# EAGLE design sim800 (EAGLE 9.2.2)

## Sheet 1 of 3
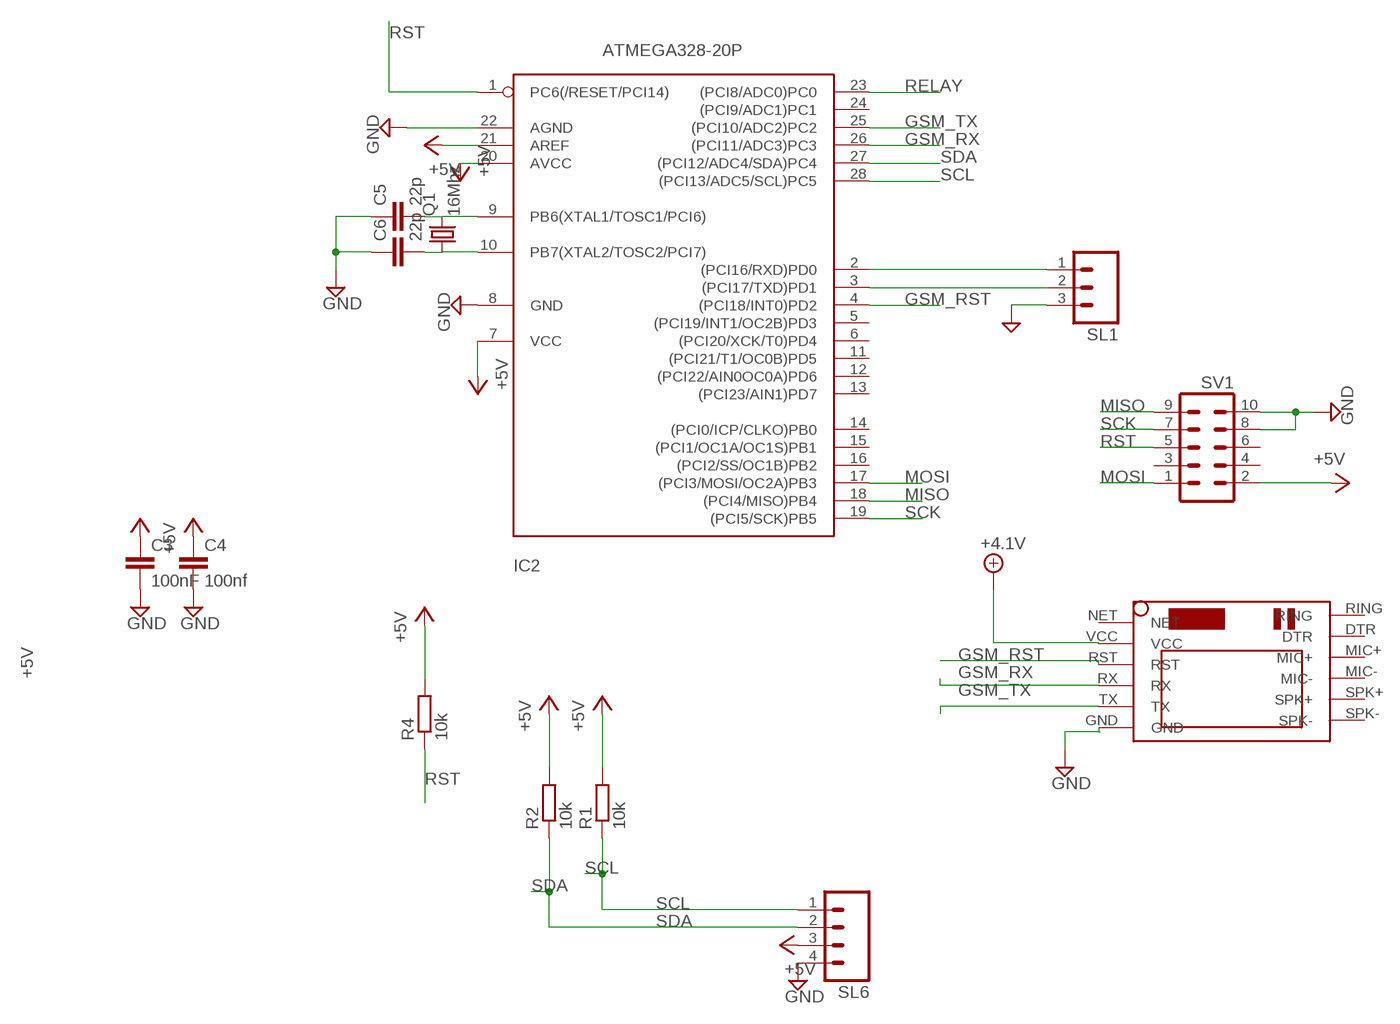
[diagram p0: schematic, sheet 1]

### Parts
C3  100nF  C-EU050-025X075  [C050-025X075]
C4  100nf  C-EU050-025X075  [C050-025X075]
C5  22p  C-EU025-025X050  [C025-025X050]
C6  22p  C-EU025-025X050  [C025-025X050]
IC2  ATMEGA328-20P  [DIL28-3]
Q1  16Mhz  CRYSTALHC49U-V  [HC49U-V]
R1  10k  R-EU_0207/10  [0207/10]
R2  10k  R-EU_0207/10  [0207/10]
R4  10k  R-EU_0207/10  [0207/10]
SL1  M03  [03P]
SL6  M04  [04P]
SV1  ML10  [ML10]
U$1  SIM800LMODULE  [SIM800LMODULE]

### Nets
+4.1V: U$1.VCC ; also sheet 3
+5V: C3.1 C4.1 IC2.7(VCC) IC2.20(AVCC) IC2.21(AREF) R1.2 R2.2 R4.2 SL6.3 SV1.2 ; also sheet 2,3
GND: C3.2 C4.2 C5.1 C6.1 IC2.8(GND) IC2.22(AGND) SL1.3 SL6.4 SV1.8 SV1.10 U$1.GND ; also sheet 2,3
GSM_RST: IC2.4((PCI18/INT0)PD2) U$1.RST
GSM_RX: IC2.26((PCI11/ADC3)PC3) U$1.RX
GSM_TX: IC2.25((PCI10/ADC2)PC2) U$1.TX
MISO: IC2.18((PCI4/MISO)PB4) SV1.9
MOSI: IC2.17((PCI3/MOSI/OC2A)PB3) SV1.1
N$1: C5.2 IC2.9(PB6(XTAL1/TOSC1/PCI6)) Q1.2
N$2: C6.2 IC2.10(PB7(XTAL2/TOSC2/PCI7)) Q1.1
N$3: IC2.2((PCI16/RXD)PD0) SL1.1
N$6: IC2.3((PCI17/TXD)PD1) SL1.2
RELAY: IC2.23((PCI8/ADC0)PC0) ; also sheet 2
RST: IC2.1(PC6(/RESET/PCI14)) R4.1 SV1.5
SCK: IC2.19((PCI5/SCK)PB5) SV1.7
SCL: IC2.28((PCI13/ADC5/SCL)PC5) R1.1 SL6.1
SDA: IC2.27((PCI12/ADC4/SDA)PC4) R2.1 SL6.2
Unconnected: IC2.5((PCI19/INT1/OC2B)PD3) IC2.6((PCI20/XCK/T0)PD4) IC2.11((PCI21/T1/OC0B)PD5) IC2.12((PCI22/AIN0OC0A)PD6) IC2.13((PCI23/AIN1)PD7) IC2.14((PCI0/ICP/CLKO)PB0) IC2.15((PCI1/OC1A/OC1S)PB1) IC2.16((PCI2/SS/OC1B)PB2) IC2.24((PCI9/ADC1)PC1) SV1.3 SV1.4 SV1.6 U$1.DTR U$1.MIC+ U$1.MIC- U$1.NET U$1.RING U$1.SPK+ U$1.SPK-

## Sheet 2 of 3
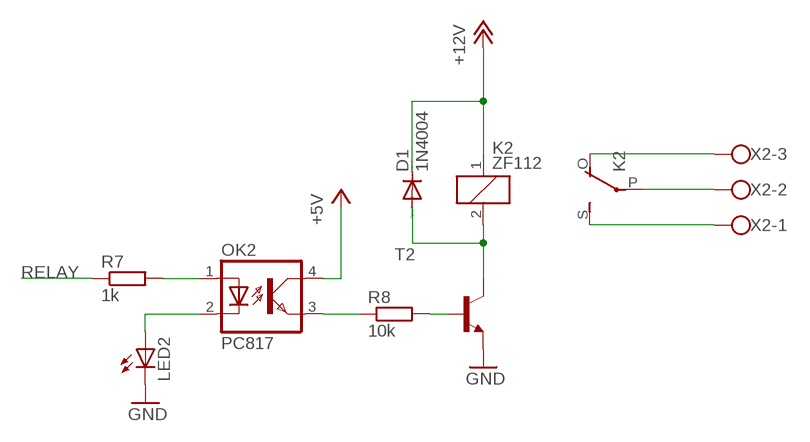
[diagram p1: schematic, sheet 2]

### Parts
D1  1N4004  [DO41-10]
K2  ZF112  [ZF112]
LED2  LED3MM  [LED3MM]
OK2  PC817  [DIL04]
R7  1k  R-EU_0207/10  [0207/10]
R8  10k  R-EU_0207/10  [0207/10]
T2  -NPN-TO92-EBC  [TO92-EBC]
X2  W237-103  [W237-103]

### Nets
+5V: OK2.4(COL) ; also sheet 1,3
+12V: D1.C K2.1 ; also sheet 3
GND: LED2.K(C) T2.E ; also sheet 1,3
N$14: OK2.1(A) R7.2
N$15: LED2.A OK2.2(C)
N$16: OK2.3(EMIT) R8.1
N$17: R8.2 T2.B
N$18: D1.A K2.2 T2.C
N$19: K2.P(2:P) X2.2
N$20: K2.S(2:S) X2.1
N$21: K2.O(2:O) X2.3
RELAY: R7.1 ; also sheet 1

## Sheet 3 of 3
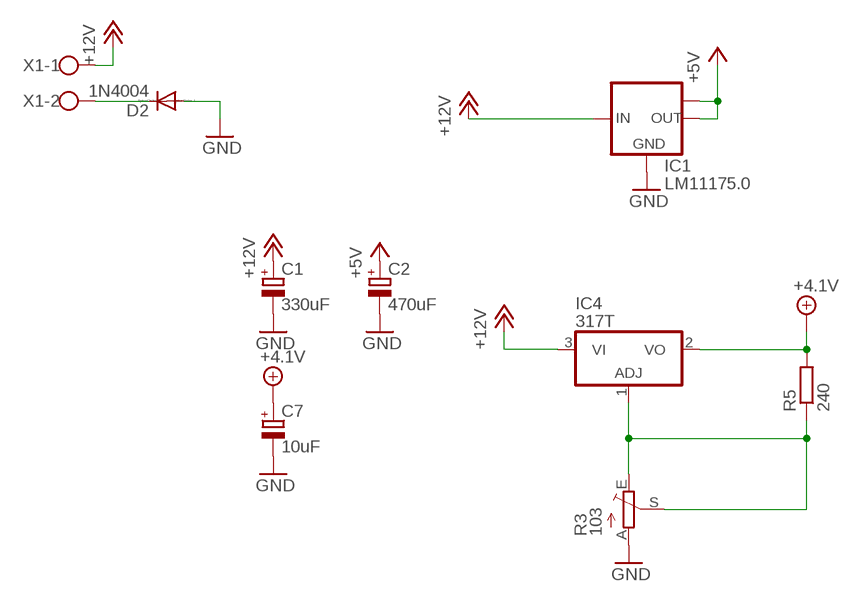
[diagram p2: schematic, sheet 3]

### Parts
C1  330uF  CPOL-EUE3.5-8  [E3,5-8]
C2  470uF  CPOL-EUE3.5-8  [E3,5-8]
C7  10uF  CPOL-EUE2.5-6  [E2,5-6]
D2  1N4004  [DO41-10]
IC1  LM11175.0  LM1117MPX-5.0  [SOT223]
IC4  317T  [TO220H]
R3  103  TRIM_EU-CA6V  [CA6V]
R5  240  R-EU_0207/10  [0207/10]
X1  W237-102  [W237-102]

### Nets
+4.1V: C7.+ IC4.2(VO) R5.2 ; also sheet 1
+5V: C2.+ IC1.2(OUT) IC1.TAB(OUT1) ; also sheet 1,2
+12V: C1.+ IC1.3(IN) IC4.3(VI) X1.1 ; also sheet 2
GND: C1.- C2.- C7.- D2.A IC1.1(GND) R3.A ; also sheet 1,2
N$4: D2.C X1.2
N$7: IC4.1(ADJ) R3.E R3.S R5.1

## Library data of the parts
C1 C2 C7 = rcl:CPOL-EU: POLARIZED CAPACITOR, European symbol; SPICEPREFIX: C
C3-C6 = rcl:C-EU: CAPACITOR, European symbol
D1 D2 = diode:1N4004: DIODE general purpose rectifier, 1 A
IC1 = lm1117:LM1117MPX-*
IC2 = atmega328:ATMEGA328*P: MICROCONTROLLER 32 kBytes FLASH 2 kBytes SRAM 1 kBytes EEPROM USART 8-channel 10 bit ADC
IC4 = linear:*317: Positive VOLTAGE REGULATOR
K2 = relay:ZF112: RELAY 1 x switch; OC_FARNELL: unknown; OC_NEWARK: unknown
LED2 = led:LED: LED OSRAM: - CHIPLED LG R971, LG N971, LY N971, LG Q971, LY Q971, LO R971, LY R971 LH N974, LH R974 LS Q976, LO Q976, LY Q976 LO Q996 - Hyper CHIPLED LW Q18S LB Q993, LB Q99A, LB R99A - SideLED LS A670, LO A670, LY A670, LG A670, LP A670 LB A673, LV A673, LT A673, LW A673 LH A674 LY A675 LS A676, LA A676, LO A676, LY A676, LW A676 LS A679, LY A679, LG A679 - Hyper Micro SIDELED® LS Y876, LA Y876, LO Y876, LY Y876 LT Y87S - SmartLED LW L88C, LW L88S LB L89C, LB L89S, LG L890 LS L89K, LO L89K, LY L89K LS L896, LA L896, LO L896, LY L896 - TOPLED LS T670, LO T670, LY T670, LG T670, LP T670 LSG T670, LSP T670, LSY T670, LOP T670, LYG T670 LG T671, LOG T671, LSG T671 LB T673, LV T673, LT T673, LW T673 LH T674 LS T676, LA T676, LO T676, LY T676, LB T676, LH T676, LSB T676, LW T676 LB T67C, LV T67C, LT T67C, LS T67K, LO T67K, LY T67K, LW E67C LS E67B, LA E67B, LO E67B, LY E67B, LB E67C, LV E67C, LT E67C LW T67C LS T679, LY T679, LG T679 LS T770, LO T770, LY T770, LG T770, LP T770 LB T773, LV T773, LT T773, LW T773 LH T774 LS E675, LA E675, LY E675, LS T675 LS T776, LA T776, LO T776, LY T776, LB T776 LHGB T686 LT T68C, LB T68C - Hyper Mini TOPLED® LB M676 - Mini TOPLED Santana® LG M470 LS M47K, LO M47K, LY M47K Source: http://www.osram.convergy.de LUXEON: - LUMILED® LXK2-PW12-R00, LXK2-PW12-S00, LXK2-PW14-U00, LXK2-PW14-V00 LXK2-PM12-R00, LXK2-PM12-S00, LXK2-PM14-U00 LXK2-PE12-Q00, LXK2-PE12-R00, LXK2-PE12-S00, LXK2-PE14-T00, LXK2-PE14-U00 LXK2-PB12-K00, LXK2-PB12-L00, LXK2-PB12-M00, LXK2-PB14-N00, LXK2-PB14-P00, LXK2-PB14-Q00 LXK2-PR12-L00, LXK2-PR12-M00, LXK2-PR14-Q00, LXK2-PR14-R00 LXK2-PD12-Q00, LXK2-PD12-R00, LXK2-PD12-S00 LXK2-PH12-R00, LXK2-PH12-S00 LXK2-PL12-P00, LXK2-PL12-Q00, LXK2-PL12-R00 Source: www.luxeon.com KINGBRIGHT: KA-3528ASYC Source: www.kingbright.com
OK2 = optocoupler:PC817: SHARP OPTO COUPLER; MPN: PC817X4J000F; OC_FARNELL: 9707727; OC_NEWARK: 97K7059
Q1 = crystal:CRYSTAL: CRYSTAL; OC_FARNELL: 1666969; OC_NEWARK: unknown
R1 R2 R4 R5 R7 R8 = rcl:R-EU_: RESISTOR, European symbol; SPICEPREFIX: R
R3 = pot:TRIM_EU-: POTENTIOMETER
SL1 = con-amp-quick:M03: AMP QUICK CONNECTOR; OC_FARNELL: unknown; OC_NEWARK: unknown
SL6 = con-amp-quick:M04: AMP QUICK CONNECTOR; OC_FARNELL: unknown; OC_NEWARK: unknown
SV1 = con-harting-ml:ML10: HARTING; OC_FARNELL: unknown; OC_NEWARK: unknown
T2 = transistor:*-NPN-: NPN Transistror BF959 corrected 2008.03.06
U$1 = SIM800LMODULE:SIM800LMODULE: SIM800L Module
X1 = con-wago-500:W237-102: WAGO SCREW CLAMP; MPN: 237-102; OC_FARNELL: unknown; OC_NEWARK: 70K9898
X2 = con-wago-500-edit:W237-103: WAGO SCREW CLAMP; MPN: 237-103; OC_FARNELL: unknown; OC_NEWARK: 18M7116

## Net classes
0 default: width 0.152 mm, drill 0.152 mm, clearance 0.152 mm

## Board
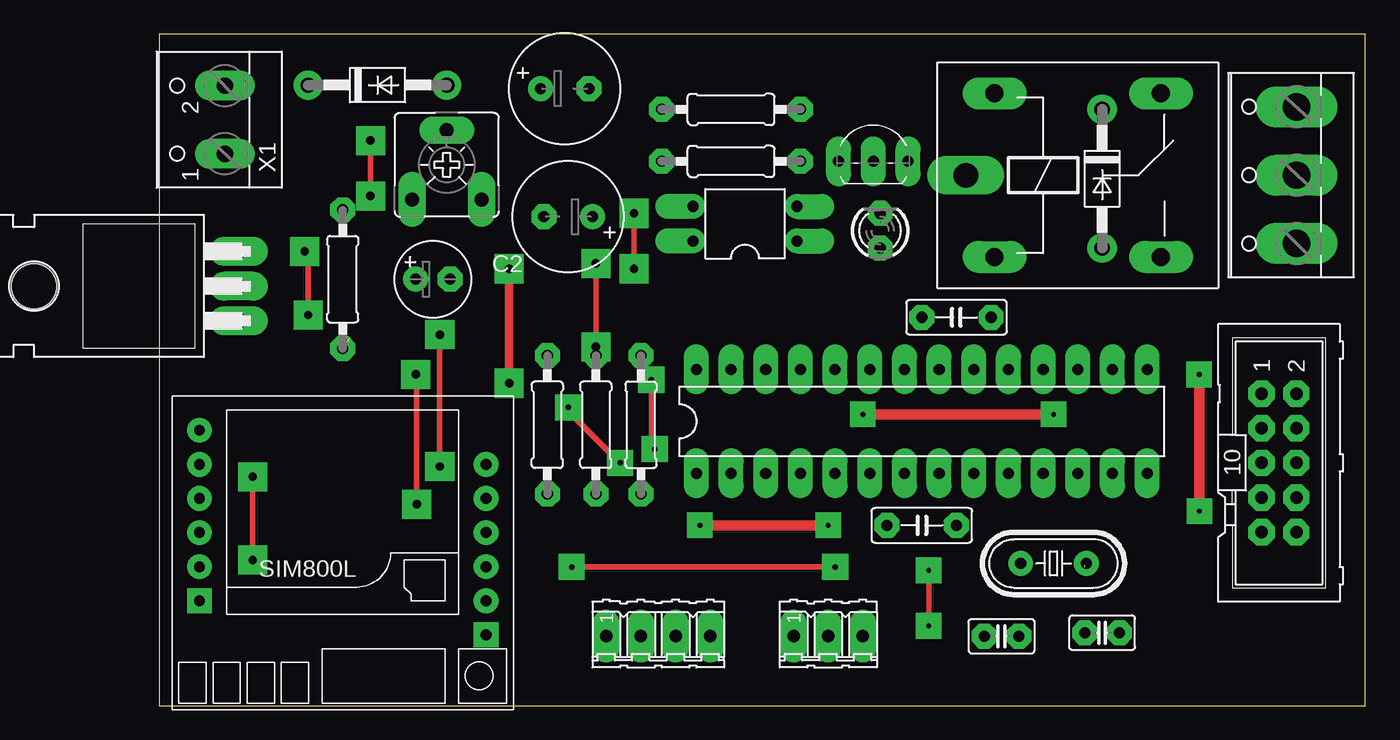
[diagram p3: board, top side]
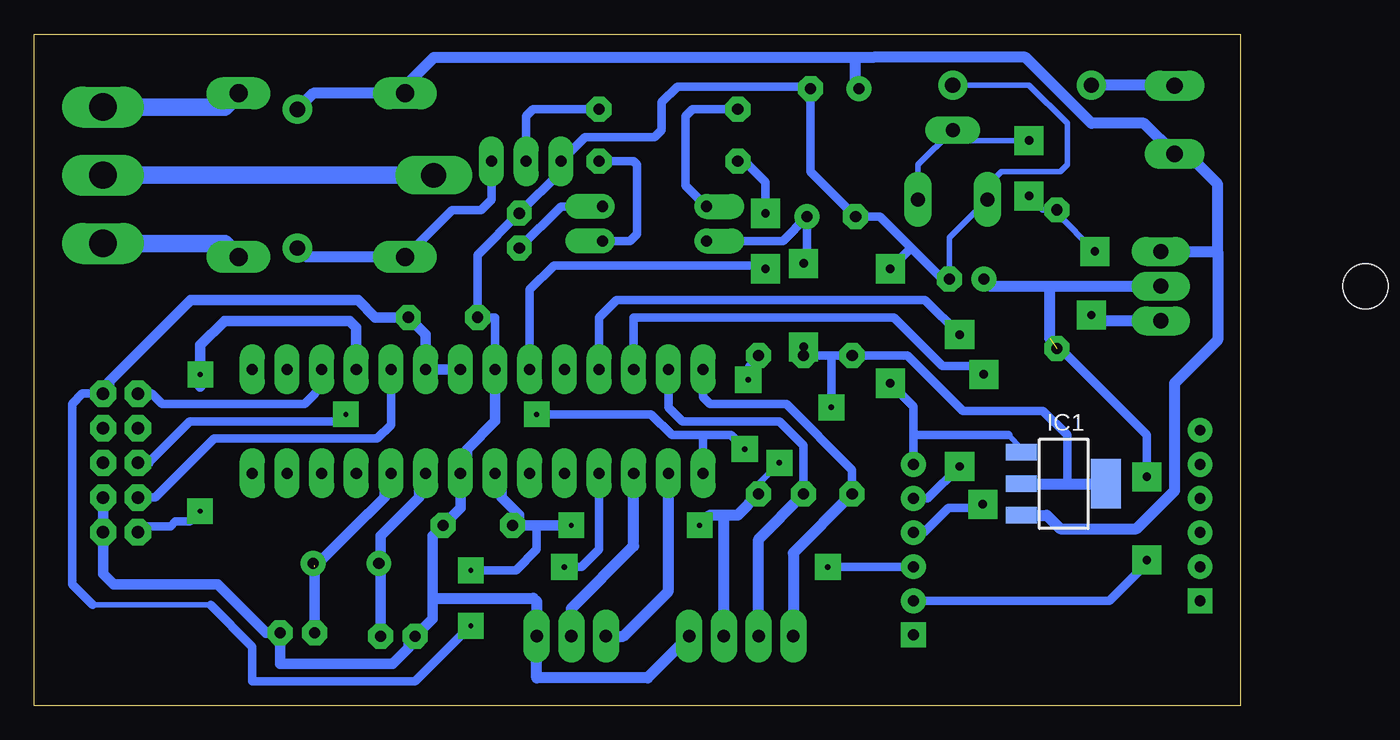
[diagram p4: board, bottom side, seen from below]

Size 88.37 x 49.2 mm. Coordinates in mm from the lower left corner, seen from the top.
Outline: 0,0 88.37,0 88.37,49.2 0,49.2 0,0
Copper layers (1*16): Top 0.035mm / dielectric 1.5mm / Bottom 0.035mm
Design rules "setting *": minimum track width 16mil, minimum drill 24mil, track to track 8mil, track to pad 8mil, pad to pad 8mil, via to via 8mil, smd to smd 8mil, copper to edge 50mil, drill to drill 30mil, minimum pad ring 20mil, minimum via ring 30mil, stop-mask expansion 0mil, vias tented up to drill 0mil, thermal gap 10mil

### Footprints (pad centres in the part's own frame; a part is rotated, then mirrored left to right if it is on the bottom)
E3,5-8 = drill 0.813 pad 1.6: + -1.778,0 | drill 0.813 pad 1.6 octagon: - 1.778,0
C050-025X075 = drill 0.813 octagon: 1 -2.54,0; 2 2.54,0
C025-025X050 = drill 0.813 octagon: 1 -1.27,0; 2 1.27,0
E2,5-6 = drill 0.813 pad 1.6: + -1.27,0 | drill 0.813 pad 1.6 octagon: - 1.27,0
DO41-10 = drill 1.118: A 5.08,0; C -5.08,0
SOT223 = smd 1.219 x 2.235: 1 -2.311,-3.099; 2 0,-3.099; 3 2.311,-3.099 | smd 3.6 x 2.2: TAB 0,3.099
DIL28-3 = drill 0.813 long: 1 -16.51,-3.81; 2 -13.97,-3.81; 3 -11.43,-3.81; 4 -8.89,-3.81; 5 -6.35,-3.81; 6 -3.81,-3.81; 7 -1.27,-3.81; 8 1.27,-3.81; 9 3.81,-3.81; 10 6.35,-3.81; 11 8.89,-3.81; 12 11.43,-3.81; 13 13.97,-3.81; 14 16.51,-3.81; 15 16.51,3.81; 16 13.97,3.81; 17 11.43,3.81; 18 8.89,3.81; 19 6.35,3.81; 20 3.81,3.81; 21 1.27,3.81; 22 -1.27,3.81; 23 -3.81,3.81; 24 -6.35,3.81; 25 -8.89,3.81; 26 -11.43,3.81; 27 -13.97,3.81; 28 -16.51,3.81
TO220H = drill 1.118 long: 1 -2.54,-10.16; 2 0,-10.16; 3 2.54,-10.16 | hole 3.302: 0,4.826
ZF112 = drill 1.321 long: 1 -6.096,5.994; 2 -6.096,-5.994; O 6.096,5.994; S 6.096,-5.994 | drill 1.803 long: P -8.204,0
LED3MM = drill 0.813 octagon: A -1.27,0; K 1.27,0
DIL04 = drill 0.813 offset: 1 -1.27,-3.81; 2 1.27,-3.81; 3 1.27,3.81; 4 -1.27,3.81
HC49U-V = drill 0.813: 1 -2.413,0; 2 2.413,0
0207/10 = drill 0.813 octagon: 1 -5.08,0; 2 5.08,0
CA6V = drill 1.016 long: A -2.54,-2.54; E 2.54,-2.54; S 0,2.54
03P = drill 0.914 long: 1 -2.54,0; 2 0,0; 3 2.54,0
04P = drill 0.914 long: 1 -3.81,0; 2 -1.27,0; 3 1.27,0; 4 3.81,0
ML10 = drill 0.914 octagon: 1 -5.08,-1.27; 2 -5.08,1.27; 3 -2.54,-1.27; 4 -2.54,1.27; 5 0,-1.27; 6 0,1.27; 7 2.54,-1.27; 8 2.54,1.27; 9 5.08,-1.27; 10 5.08,1.27
TO92-EBC = drill 0.813 long: B 0,-1.27; C 2.54,-1.27; E -2.54,-1.27
SIM800LMODULE = drill 0.8: DTR 10.5,1; GND -10.5,-6.5; MIC+ 10.5,-1.5; MIC- 10.5,-4; RST -10.5,1; RX -10.5,-1.5; SPK+ 10.5,-6.5; SPK- 10.5,-9; TX -10.5,-4; VCC -10.5,3.5 | drill 0.8 square: NET -10.5,6; RING 10.5,3.5
W237-102 = drill 1.194 long: 1 -2.5,-1.27; 2 2.5,-1.27
W237-103 = drill 2 long: 1 -5,-1.29; 2 0,-1.29; 3 5,-1.29

### Placement (x,y rotation side)
C1  29.72,45.21 0 top
C2  29.97,35.81 180 top
C3  55.88,13.21 0 top
C4  58.42,28.45 180 top
C5  61.72,5.08 0 top
C6  69.09,5.33 180 top
C7  20.07,31.24 0 top
D1  69.09,38.61 270 top
D2  16,45.47 0 top
IC1  12.95,16.26 270 bottom
IC2  55.88,20.83 0 top
IC4  -4.32,30.73 90 top
K2  67.31,38.86 0 top
LED2  52.83,34.8 90 top
OK2  42.93,35.31 90 top
Q1  65.53,10.41 180 top
R1  28.45,20.57 90 top
R2  32,20.57 90 top
R3  21.08,39.62 0 top
R4  35.31,20.57 270 top
R5  13.46,31.24 270 top
R7  41.91,39.88 0 top
R8  41.91,43.69 0 top
SL1  49.02,5.08 0 top
SL6  36.58,5.08 0 top
SV1  82.04,17.78 270 top
T2  52.32,41.15 0 top
U$1  13.46,11.18 180 top
X1  3.56,42.93 90 top
X2  82.04,38.86 90 top

### Tracks (layer width: path | path; a pad name or v marks a point on that pad's centre or on a via)
+4.1V  (via drill 0.61)  (1 unrouted)
  Top 0.406: v6.86,16.76 v6.86,10.67
  Bottom 0.406: 6.86,10.41 v6.86,10.67
  Bottom 0.61: U$1.VCC 9.6,7.68 6.86,10.41 | v6.86,16.76 6.86,19.81 13.97,26.92
  Bottom 0.813: 13.97,30.73 18.29,30.73 C7.+ | 13.97,30.73 IC4.2 | 13.97,26.92 13.97,30.73
+5V  (via drill 0.35, 0.4, 0.61)
  Top 0.406: v56.39,5.84 v56.39,9.91 | v33.78,17.78 29.97,21.59 v29.97,21.84 | v32,26.28 v32,32.4
  Top 0.762: v49.02,13.21 v39.62,13.21
  Bottom 0.406: 84.07,7.37 75.44,7.37 | R4.2 35.31,16.26 v33.78,17.78 | v29.97,21.84 29.97,22.1 29.72,22.35 | R2.2 v32,26.28
  Bottom 0.61: SV1.2 84.84,22.86 85.6,22.1 85.6,8.89 84.07,7.37 | 75.44,7.37 72.39,4.32 72.39,1.78 60.45,1.78 v56.39,5.84 | v56.39,9.91 53.09,9.91 51.56,11.43 51.56,13.21 | R2.2 29.97,25.65 | 29.97,25.65 R1.2 24.38,25.65 20.32,21.59 14.48,21.59 12.7,19.81 12.7,16.26 | 29.97,22.1 29.97,25.65 | OK2.4 33.53,34.04 C2.+ 31.75,32.4 v32,32.4 32,32
  Bottom 0.762: C3.1 52.83,13.21 | 52.83,13.21 51.56,13.21 v49.02,13.21 | IC2.7 54.13,16.53 54.13,15.25 52.83,13.96 52.83,13.21 | IC2.21 IC2.20 59.69,27.18 C4.1 63.38,28.45 64.65,29.72 76.89,29.72 82.88,23.73 82.88,23.29 SV1.2
  Bottom 0.813: v39.62,13.21 38.86,13.97 37.85,13.97 | 37.85,13.97 36.83,13.97 R4.2 | SL6.3 37.85,13.97 | IC1.2 12.7,16.26 IC1.TAB
+12V
  Bottom 0.61: C1.+ 28.19,45.47
  Bottom 0.813: 61.32,44.96 K2.1 61.72,44.86 | 61.72,44.86 67.92,44.86 D1.C | 1.68,33.27 1.68,38.2 3.9,40.43 X1.1 7.07,42.67 10.92,42.67 15.75,47.5 26.9,47.5 26.92,47.47 28.19,47.47 | 1.68,33.27 1.68,26.77 4.83,23.62 4.83,15.75 7.62,12.95 13.21,12.95 14.2,13.94 IC1.3 | IC4.3 1.68,33.27 | 61.72,44.86 59.11,47.47 28.19,47.47 | 28.19,45.47 28.19,47.47
GND  (via drill 0.61)
  Top 0.61: v25.65,23.62 v25.65,32
  Bottom 0.406: 59.18,7.87 57.4,7.87 | C7.- 21.34,34.29 R3.A 18.54,38.1 17.53,39.12 13.21,39.12 12.7,39.62 12.7,42.67 15.49,45.47 D2.A | IC1.1 16.05,18.85 17.02,19.81
  Bottom 0.61: C7.- 21.84,31.24 24.26,33.66 | 24.26,33.66 26.42,35.81 C2.- 31.5,39.12 C1.- 31.5,45.36 41.25,45.36 42.42,44.2 42.42,42.16 42.93,41.66 48.01,41.66 T2.E 49.78,39.12 LED2.K 55.88,33.02 C4.2 54.61,28.45 IC2.22 | U$1.GND 23.96,19.81 | 17.02,19.81 23.96,19.81 | 23.96,19.81 23.96,21.93 v25.65,23.62 | v25.65,32 24.26,33.4 24.26,33.66
  Bottom 0.762: SV1.8 SV1.10 83.31,9.65 82.55,8.89 74.93,8.89 71.37,5.33 C6.1 70.36,3.05 62.11,3.05 60.93,4.23 60.93,4.6 C5.1 59.18,6.35 59.18,7.87 59.18,12.45 C3.2 57.15,14.48 IC2.8 56.67,17.5 56.67,18.78 54.61,20.84 IC2.22
  Bottom 0.813: 59.18,7.87 51.82,7.87 51.56,7.62 SL1.3 51.56,2.03 43.43,2.03 SL6.4
GSM_RST  (via drill 0.4)
  Top 0.406: v30.23,10.16 v49.53,10.16
  Bottom 0.406: 30.21,10.18 v30.23,10.16
  Bottom 0.61: U$1.RST 30.21,10.18 | v49.53,10.16 48.26,10.16 46.99,11.43 IC2.4
GSM_RX  (via drill 0.61)
  Top 0.406: v18.88,14.75 18.88,23.69 18.81,23.76 v18.81,24.27
  Bottom 0.61: U$1.RX 23.2,12.68 21.38,14.49 19.14,14.49 v18.88,14.75 | v18.81,24.27 19.44,24.89 21.84,24.89 25.4,28.45 44.45,28.45 IC2.26
GSM_TX  (via drill 0.61)
  Top 0.406: v20.57,17.53 v20.57,27.18
  Bottom 0.61: U$1.TX 22.92,15.18 v20.57,17.53 | v20.57,27.18 23.11,29.72 45.72,29.72 46.99,28.45 IC2.25
MISO  (via drill 0.35)
  Top 0.762: v76.22,14.24 76.22,24.24 v76.2,24.26
  Bottom 0.406: SV1.9 80.34,13.13
  Bottom 0.61: 80.34,13.13 78.38,13.13 78.03,13.48 76.98,13.48 v76.22,14.24
  Bottom 0.762: 76.2,23.37 v76.2,24.26 76.2,26.42 74.42,28.19 65.28,28.19 64.77,27.69 IC2.18
MOSI
  Bottom 0.406: 67.79,24.16 67.79,22.87
  Bottom 0.61: 67.79,22.87 68.57,22.1 78.99,22.1 79.76,22.86 SV1.1
  Bottom 0.762: IC2.17 67.79,24.16
N$1
  Bottom 0.762: C5.2 62.99,10.67 | 62.99,10.67 63.12,10.79 | 63.25,10.92 63.12,10.79 | 63.12,10.79 Q1.2 | IC2.9 60.17,16.53 60.17,15.25 62.99,12.43 62.99,10.67
N$2  (1 unrouted)
  Bottom 0.762: C6.2 67.82,10.16 63.93,14.05 63.92,14.05 62.71,15.25 62.71,16.53 IC2.10 | 67.82,10.29 Q1.1
N$3
  Bottom 0.813: SL1.1 45.21,5.08 41.91,8.38 IC2.2
N$4
  Bottom 0.813: X1.2 4.87,45.47 D2.C
N$6
  Bottom 0.813: SL1.2 49.02,7.11 44.45,11.68 IC2.3
N$7  (via drill 0.61)
  Top 0.406: v15.49,37.34 v15.49,41.4 | 10.92,28.7 10.92,33.02 v10.67,33.27
  Top 0.813: v10.92,28.62 10.92,28.7
  Bottom 0.406: R3.E 23.62,39.62 R3.S 20.32,41.4 v15.49,41.4 | v15.49,37.34 14.48,36.32 R5.1 13.46,36.07 v10.67,33.27 | 10.16,28.19 IC4.1
  Bottom 0.813: IC4.1 10.92,28.19 v10.92,28.62
N$14
  Bottom 0.61: OK2.1 44.7,34.04 44.2,34.54 44.2,39.62 44.45,39.88 R7.2
N$15
  Bottom 0.61: LED2.A 49.78,36.58 OK2.2
N$16
  Bottom 0.61: OK2.3 40.64,38.1 40.64,43.18 40.13,43.69 R8.1
N$17
  Bottom 0.61: T2.B 52.32,43.18 51.82,43.69 R8.2
N$18
  Bottom 0.61: K2.2 57.76,36.32 55.63,36.32 54.86,37.08 T2.C
  Bottom 0.813: D1.A 68.43,32.87 K2.2
N$19
  Bottom 1.27: X2.2 K2.P
N$20
  Bottom 1.27: X2.1 74.4,33.86 K2.S
N$21
  Bottom 1.27: K2.O 74.4,43.86 X2.3
RELAY  (via drill 0.61)
  Top 0.406: v34.8,32 v34.8,36.07
  Bottom 0.61: IC2.23 52.07,30.48 50.29,32.26 35.05,32.26 v34.8,32 | v34.8,36.07 34.8,38.35 36.32,39.88 R7.1
RST  (via drill 0.35, 0.4)
  Top 0.406: v36.32,18.8 36.07,19.05 v36.07,23.88
  Top 0.762: v65.53,21.34 v51.56,21.34
  Bottom 0.406: 66.29,20.83 65.79,21.34 v65.53,21.34 | 39.62,19.81 39.37,19.56 | v36.07,23.88 36.07,24.89 R4.1
  Bottom 0.61: 80.01,17.78 76.96,20.83 66.29,20.83 | v51.56,21.34 43.18,21.34 41.66,19.81 39.62,19.81 37.34,19.81 v36.32,18.8 | 39.37,19.56 IC2.1
  Bottom 0.762: 38.99,17.4 IC2.1 | SV1.5 80.01,17.78
SCK
  Bottom 0.61: IC2.19 62.23,20.57 63.25,19.56 75.18,19.56 79.5,15.24 SV1.7
SCL
  Bottom 0.61: R1.1 28.45,17.27 33.27,22.1 38.86,22.1 39.37,22.61 IC2.28
  Bottom 0.813: R1.1 32.77,11.18 SL6.1
SDA
  Bottom 0.61: R2.1 32,19.05 33.78,20.83 40.89,20.83 41.91,21.84 IC2.27
  Bottom 0.813: R2.1 35.31,12.19 SL6.2